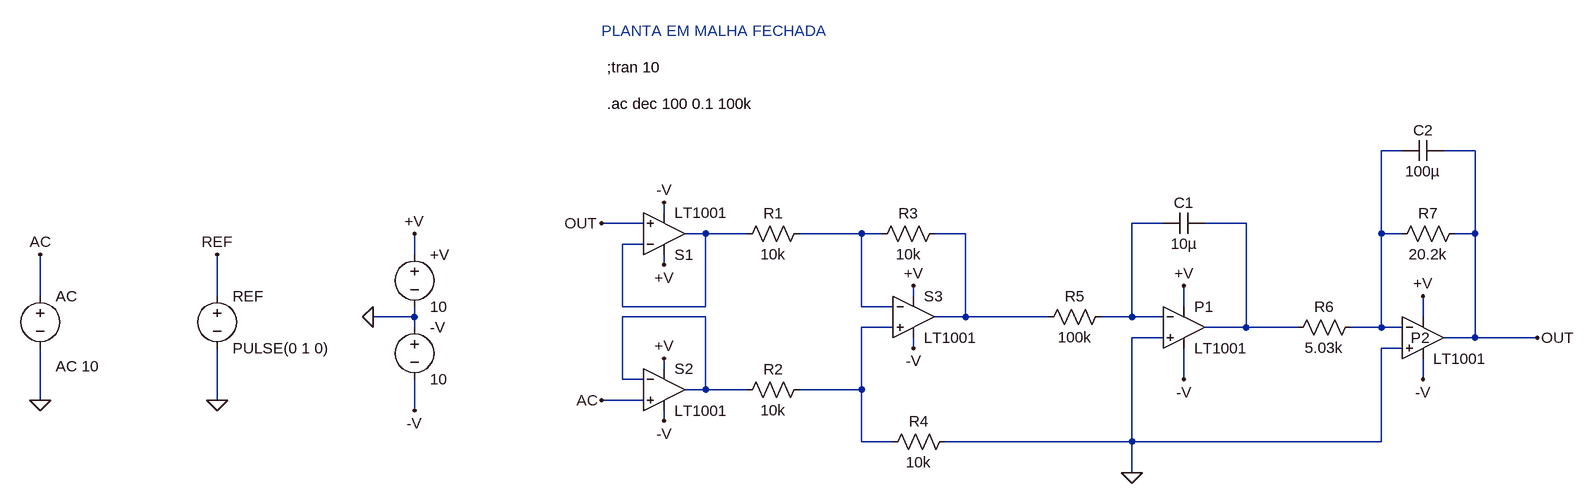
[diagram p0: schematic CL.asc]
CL.asc, the LTspice schematic file:
Version 4
SHEET 1 1932 680
WIRE 880 -80 848 -80
WIRE 992 -80 944 -80
WIRE -256 16 -256 0
WIRE -288 32 -352 32
WIRE 512 32 464 32
WIRE 640 32 576 32
WIRE -192 48 -224 48
WIRE -128 48 -192 48
WIRE 48 48 -48 48
WIRE 80 48 48 48
WIRE 208 48 160 48
WIRE 848 48 848 -80
WIRE 880 48 848 48
WIRE 992 48 992 -80
WIRE 992 48 960 48
WIRE -288 64 -320 64
WIRE -640 80 -640 48
WIRE -256 96 -256 80
WIRE -1216 144 -1216 80
WIRE -944 144 -944 80
WIRE 128 144 128 128
WIRE -320 160 -320 64
WIRE -192 160 -192 48
WIRE -192 160 -320 160
WIRE 48 160 48 48
WIRE 96 160 48 160
WIRE 544 160 544 128
WIRE -640 176 -640 160
WIRE -640 176 -704 176
WIRE -192 176 -320 176
WIRE 208 176 208 48
WIRE 208 176 160 176
WIRE 336 176 208 176
WIRE 464 176 464 32
WIRE 464 176 416 176
WIRE 512 176 464 176
WIRE 912 176 912 144
WIRE -640 192 -640 176
WIRE 96 192 48 192
WIRE 640 192 640 32
WIRE 640 192 576 192
WIRE 720 192 640 192
WIRE 848 192 848 48
WIRE 848 192 800 192
WIRE 880 192 848 192
WIRE 512 208 464 208
WIRE 992 208 992 48
WIRE 992 208 944 208
WIRE 1088 208 992 208
WIRE 128 224 128 208
WIRE 880 224 848 224
WIRE -256 256 -256 240
WIRE -320 272 -320 176
WIRE -288 272 -320 272
WIRE 544 272 544 224
WIRE 912 272 912 240
WIRE -192 288 -192 176
WIRE -192 288 -224 288
WIRE -128 288 -192 288
WIRE 48 288 48 192
WIRE 48 288 -48 288
WIRE -1216 304 -1216 224
WIRE -944 304 -944 224
WIRE -288 304 -352 304
WIRE -640 320 -640 272
WIRE -256 336 -256 320
WIRE 48 368 48 288
WIRE 96 368 48 368
WIRE 464 368 464 208
WIRE 464 368 176 368
WIRE 848 368 848 224
WIRE 848 368 464 368
WIRE 464 416 464 368
FLAG -352 304 AC
FLAG -256 0 -V
FLAG 128 128 +V
FLAG -256 240 +V
FLAG -256 96 +V
FLAG 128 224 -V
FLAG -256 336 -V
FLAG -352 32 OUT
FLAG -640 48 +V
FLAG -640 320 -V
FLAG -704 176 0
FLAG -944 304 0
FLAG -944 80 REF
FLAG 544 128 +V
FLAG 912 144 +V
FLAG 544 272 -V
FLAG 912 272 -V
FLAG 1088 208 OUT
FLAG 464 416 0
FLAG -1216 304 0
FLAG -1216 80 AC
SYMBOL Opamps\\LT1001 -256 112 M180
SYMATTR InstName S1
SYMBOL Opamps\\LT1001 128 112 R0
SYMATTR InstName S3
SYMBOL Opamps\\LT1001 -256 224 R0
SYMATTR InstName S2
SYMBOL res -32 32 R90
WINDOW 0 0 56 VBottom 2
WINDOW 3 32 56 VTop 2
SYMATTR InstName R1
SYMATTR Value 10k
SYMBOL res -32 272 R90
WINDOW 0 0 56 VBottom 2
WINDOW 3 32 56 VTop 2
SYMATTR InstName R2
SYMATTR Value 10k
SYMBOL res 176 32 R90
WINDOW 0 0 56 VBottom 2
WINDOW 3 32 56 VTop 2
SYMATTR InstName R3
SYMATTR Value 10k
SYMBOL res 192 352 R90
WINDOW 0 0 56 VBottom 2
WINDOW 3 32 56 VTop 2
SYMATTR InstName R4
SYMATTR Value 10k
SYMBOL voltage -640 64 R0
WINDOW 123 0 0 Left 2
WINDOW 39 0 0 Left 2
SYMATTR InstName +V
SYMATTR Value 10
SYMBOL voltage -640 176 R0
WINDOW 123 0 0 Left 2
WINDOW 39 0 0 Left 2
SYMATTR InstName -V
SYMATTR Value 10
SYMBOL voltage -944 128 R0
WINDOW 123 0 0 Left 2
WINDOW 39 0 0 Left 2
SYMATTR InstName REF
SYMATTR Value PULSE(0 1 0)
SYMBOL Opamps\\LT1001 544 128 R0
SYMATTR InstName P1
SYMBOL Opamps\\LT1001 912 144 R0
WINDOW 0 -19 64 Left 2
SYMATTR InstName P2
SYMBOL res 432 160 R90
WINDOW 0 0 56 VBottom 2
WINDOW 3 32 56 VTop 2
SYMATTR InstName R5
SYMATTR Value 100k
SYMBOL res 816 176 R90
WINDOW 0 0 56 VBottom 2
WINDOW 3 32 56 VTop 2
SYMATTR InstName R6
SYMATTR Value 5.03k
SYMBOL res 976 32 R90
WINDOW 0 0 56 VBottom 2
WINDOW 3 32 56 VTop 2
SYMATTR InstName R7
SYMATTR Value 20.2k
SYMBOL cap 944 -96 R90
WINDOW 0 0 32 VBottom 2
WINDOW 3 32 32 VTop 2
SYMATTR InstName C2
SYMATTR Value 100µ
SYMBOL cap 576 16 R90
WINDOW 0 0 32 VBottom 2
WINDOW 3 32 32 VTop 2
SYMATTR InstName C1
SYMATTR Value 10µ
SYMBOL voltage -1216 128 R0
WINDOW 123 24 124 Left 2
WINDOW 39 0 0 Left 2
SYMATTR Value2 AC 10
SYMATTR InstName AC
SYMATTR Value ""
TEXT -352 -264 Left 2 ;PLANTA EM MALHA FECHADA
TEXT -344 -208 Left 2 !;tran 10
TEXT -344 -152 Left 2 !.ac dec 100 0.1 100k

The netlist it stands for:
* CL.asc
XS1 OUT N004 +V -V N004 LT1001  ; pins In+ In- V+ V- OUT
XS3 N008 N005 +V -V N006 LT1001  ; pins In+ In- V+ V- OUT
XS2 AC N007 +V -V N007 LT1001  ; pins In+ In- V+ V- OUT
R1 N005 N004 10k
R2 N008 N007 10k
R3 N006 N005 10k
R4 0 N008 10k
V§+V +V 0 10
V§-V 0 -V 10
V§REF REF 0 PULSE(0 1 0)
XP1 0 N002 +V -V N003 LT1001  ; pins In+ In- V+ V- OUT
XP2 0 N001 +V -V OUT LT1001  ; pins In+ In- V+ V- OUT
R5 N002 N006 100k
R6 N001 N003 5.03k
R7 OUT N001 20.2k
C2 OUT N001 100µ
C1 N003 N002 10µ
V§AC AC 0 AC 10
* PLANTA EM MALHA FECHADA
;tran 10
.ac dec 100 0.1 100k
.lib LTC.lib
.backanno
.end